# Altium schematic sheet Root.SchDoc
size A4; SheetNumber: 0
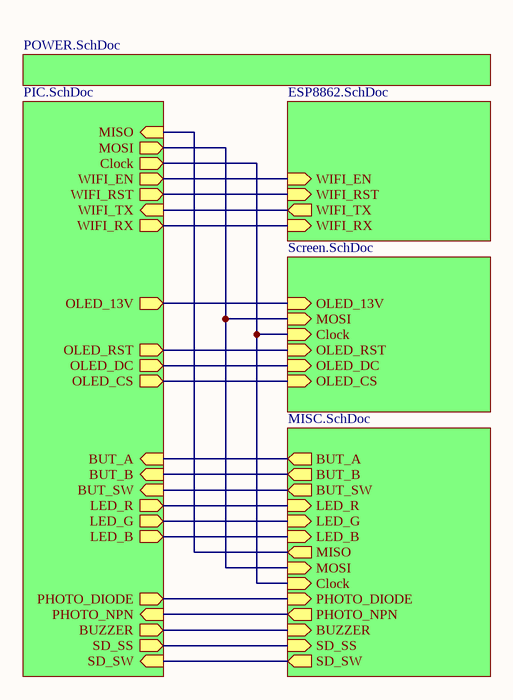
[diagram p0: Root.SchDoc]

## Sub-sheets
? = ESP8862.SchDoc: WIFI_TX (out), WIFI_RX (in), WIFI_RST (in), WIFI_EN (in)
? = MISC.SchDoc: BUT_A (out), BUT_B (out), BUT_SW (out), LED_R (in), LED_G (in), LED_B (in), SD_SS (in), MISO (out), MOSI (in), Clock (in), PHOTO_DIODE (in), PHOTO_NPN (out), BUZZER (in), SD_SW (out)
? = PIC.SchDoc: OLED_RST (out), OLED_13V (out), BUZZER (out), MISO (in), MOSI (out), SD_SS (out), OLED_DC (out), OLED_CS (out), WIFI_RST (out), LED_R (out), LED_B (out), LED_G (out), PHOTO_DIODE (out), BUT_A (in), SD_SW (in), Clock (out), BUT_SW (in), BUT_B (in), WIFI_RX (out), WIFI_TX (in), PHOTO_NPN (in), WIFI_EN (out)
? = POWER.SchDoc: no entries
? = Screen.SchDoc: OLED_13V (in), MOSI (in), Clock (in), OLED_RST (in), OLED_CS (in), OLED_DC (in)

## Nets
(unnamed): sheet /WIFI_TX, sheet /WIFI_TX
(unnamed): sheet /WIFI_RX, sheet /WIFI_RX
(unnamed): sheet /WIFI_RST, sheet /WIFI_RST
(unnamed): sheet /WIFI_EN, sheet /WIFI_EN
(unnamed): sheet /BUT_A, sheet /BUT_A
(unnamed): sheet /BUT_B, sheet /BUT_B
(unnamed): sheet /BUT_SW, sheet /BUT_SW
(unnamed): sheet /LED_R, sheet /LED_R
(unnamed): sheet /LED_G, sheet /LED_G
(unnamed): sheet /LED_B, sheet /LED_B
(unnamed): sheet /SD_SS, sheet /SD_SS
(unnamed): sheet /MISO, sheet /MISO
(unnamed): sheet /MOSI, sheet /MOSI, sheet /MOSI
(unnamed): sheet /Clock, sheet /Clock, sheet /Clock
(unnamed): sheet /PHOTO_DIODE, sheet /PHOTO_DIODE
(unnamed): sheet /PHOTO_NPN, sheet /PHOTO_NPN
(unnamed): sheet /BUZZER, sheet /BUZZER
(unnamed): sheet /SD_SW, sheet /SD_SW
(unnamed): sheet /OLED_RST, sheet /OLED_RST
(unnamed): sheet /OLED_13V, sheet /OLED_13V
(unnamed): sheet /OLED_DC, sheet /OLED_DC
(unnamed): sheet /OLED_CS, sheet /OLED_CS